# Altium schematic sheet Power.SchDoc
size A; SheetNumber: 2; SheetTotal: 3
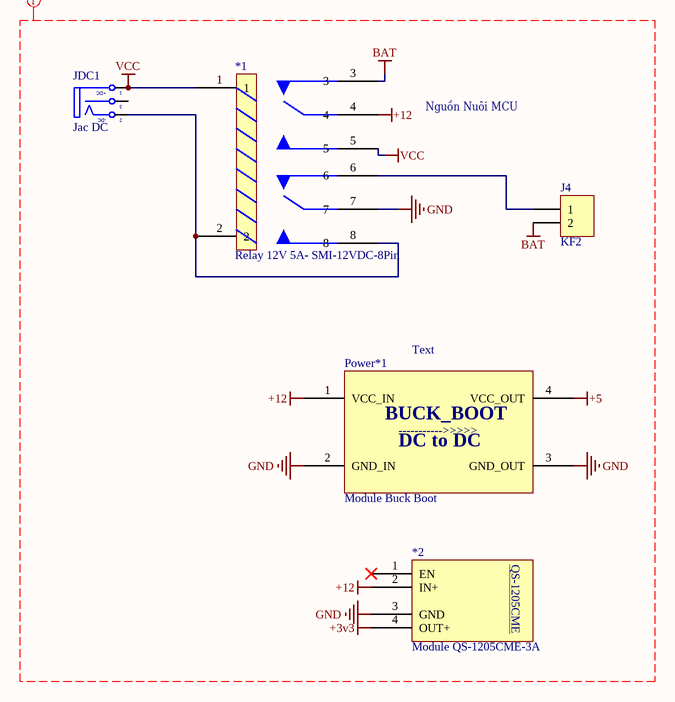
[diagram p0: Power.SchDoc]

## Parts
*1  Relay 12V 5A- SMI-12VDC-8Pin  [Relay SMI-12VDC-SL-8Pin]
*2  Module QS-1205CME-3A  [QS-1205CME-3A]
J4  KF2  [KF2-3.5]
JDC1  Jac DC  [DC-IN]
Power*1  Module Buck Boot  [Module_BUCK_BOOT]

## Nets
+3v3: *2.4(OUT+)
+5: Power*1.4(VCC_OUT)
+12: *1.4 *2.2(IN+) Power*1.1(VCC_IN)
BAT: *1.3 J4.2
GND: *1.7 *2.3(GND) Power*1.2(GND_IN) Power*1.3(GND_OUT)
VCC: *1.1 *1.5 JDC1.1(T)
Net*1_2: *1.2 *1.8 JDC1.2(TN)
Net*1_6: *1.6 J4.1

Not connected (* = marked no-connect by the designer): *2 1(EN)*; JDC1 3(S)

## Layout directives
rule Width Constraint [Pref Width = 1mm    Min Width = 0.7mm    Max Width = 1.3mm]; rule Routing Via Style [Pref Size = 2mm    Pref Hole Size = 0.711mm]: +3v3, +5, +12, BAT, GND, VCC

## Notes on the sheet
- Nguồn Nuôi MCU
- (near Power*1) Text
- (in symbol DCIN) +DC; -DC
- (in symbol Module Buck Boot) BUCK_BOOT; ----------->>>>>; DC to DC
- (in symbol Module QS-1205CME-3A) QS-1205CME

## Library data of the parts
*2 = Module QS-1205CME-3A: Mạch Hạ Áp Mini 3A Nhiều Đầu Ra QS-1205CME-3A
J4 = KF2: Manufacturer: Würth Elektronik eiSos GmbH; partNo: 691103110002; ComponentLink1 Description: Manufacturer; ComponentLink2 Description: Datasheet; NoPins: 2; Created Date: 29 October 2013; ComponentLink1URL: http://www.we-online.com; ComponentLink2URL: http://katalog.we-online.de/em/datasheet/6911031100xx.pdf; Created by: Karrer Zheng
JDC1 = DCIN: Jac DC input; Value: Jac DC